# Altium schematic sheet ESS-BoB - Top Level.SchDoc: ESS-BoB - Top Level
size A4; DrawnBy: Guy Ovadia; Engineer: Guy Ovadia; Organization: TAMI Hackerspace; DocumentNumber: xxx; Revision: REV_NOT_USED
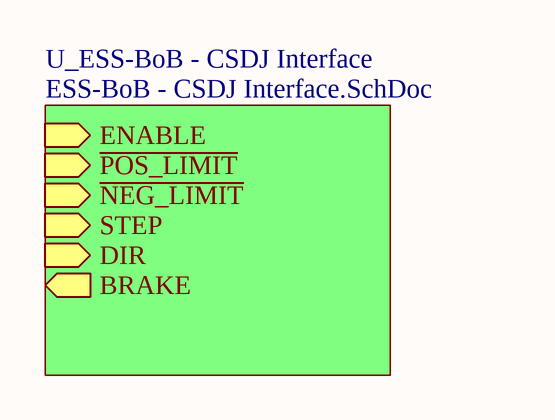
[diagram p0: ESS-BoB - Top Level.SchDoc]

## Sub-sheets
U_ESS-BoB - CSDJ Interface = ESS-BoB - CSDJ Interface.SchDoc: ENABLE (in), ~{POS_LIMIT} (in), ~{NEG_LIMIT} (in), STEP (in), DIR (in), BRAKE (out)

## Notes on the sheet
- Date:
- Revision:
- Sheet
- P/N:
- of
- File:
- Size:
- A4